# EAGLE board ESP32 Display 3.5 inch V1.0 (EAGLE 9.6.2)
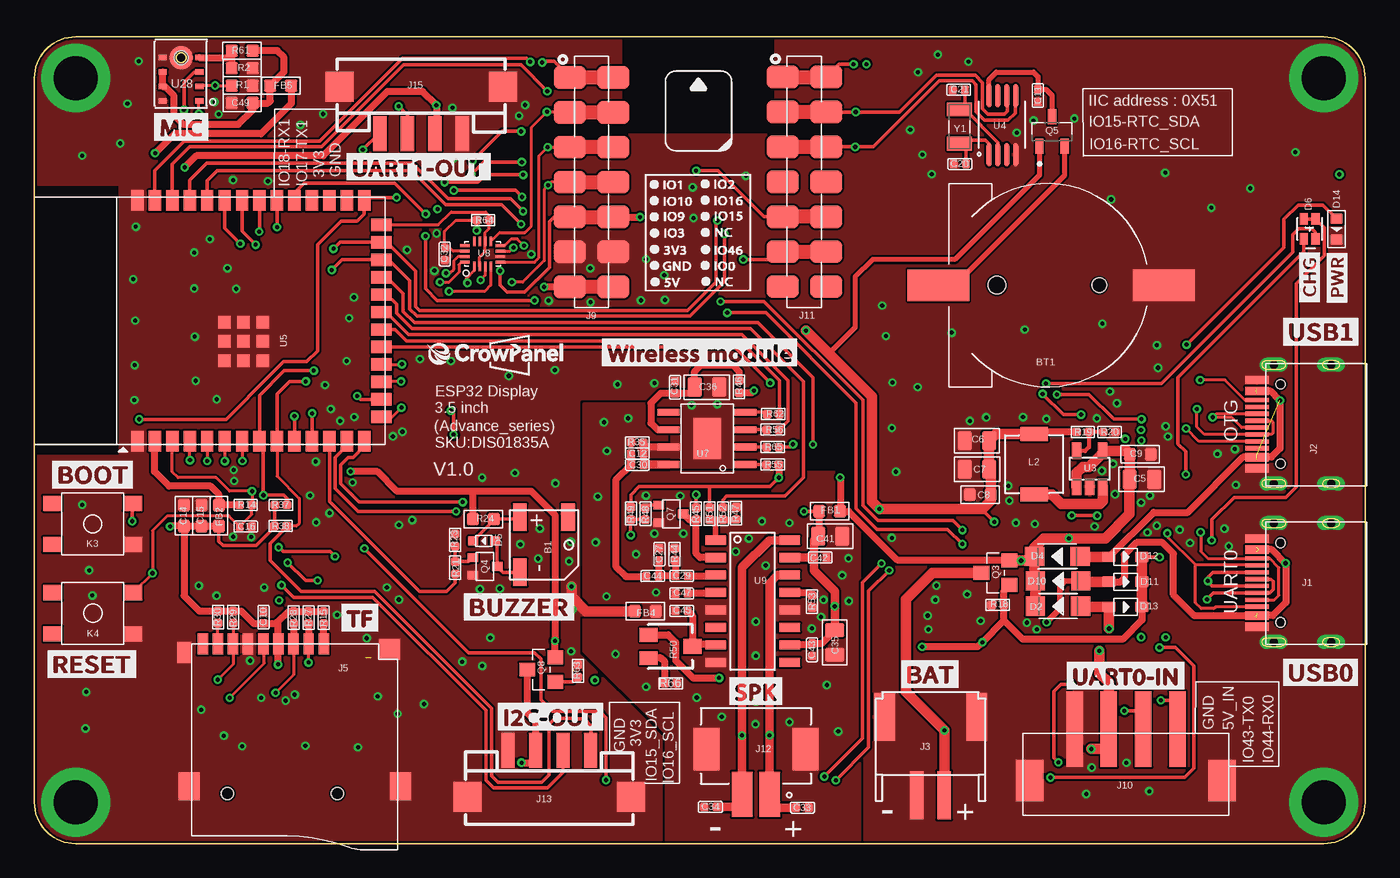
[diagram p3: board, top side]
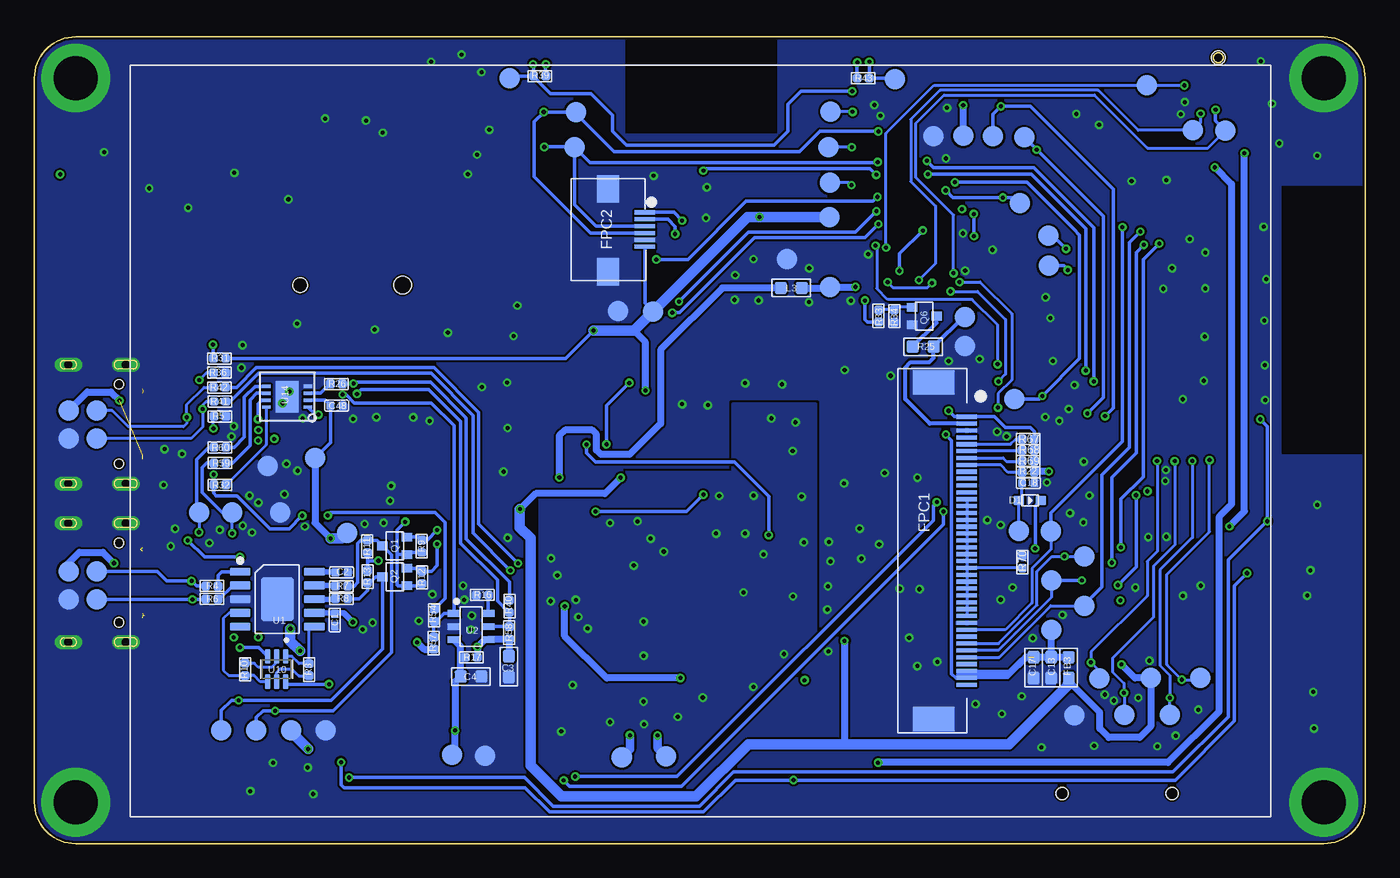
[diagram p4: board, bottom side, seen from below]

Size 96.8 x 58.7 mm. Coordinates in mm from the lower left corner, seen from the top.
Outline: 0,55.7 0,3 arc90 3,0 93.8,0 arc90 96.8,3 96.8,55.7 arc90 93.8,58.7 3,58.7 arc90 0,55.7
Copper layers (1*16): Top 0.035mm / dielectric 1.5mm / Bottom 0.035mm
Design rules "HMI_GZ *": minimum track width 8mil, minimum drill 0.3mm, track to track 6mil, track to pad 6mil, pad to pad 4mil, via to via 6mil, smd to smd 6mil, copper to edge 6mil, drill to drill 4mil, minimum pad ring 6mil, minimum via ring 6mil, stop-mask expansion 4mil, vias tented up to drill 100mil, thermal gap 0mil
tKeepout: area 51.3,17 to 62.7,25.4
tRestrict: area 0,28.3 to 6.1,47.8; area 42.8,51.7 to 53.8,58.7
bRestrict: area 0,28.3 to 6.1,47.8; area 42.8,51.7 to 53.8,58.7

## Footprints (pad centres in the part's own frame; a part is rotated, then mirrored left to right if it is on the bottom)
BEEP_5025 = smd 2 x 1: 1 -2,-1.75; 2 2,-1.75; 3 -2,1.75
CR1220 = smd 2.3 x 4.5: N 0,8.425; P 0,-7.975 | hole 1.3: 0,-3.725 | hole 1.05: 0,3.725
C0402 = smd 0.6 x 0.6: 1 -0.45,0; 2 0.45,0
C0603 = smd 0.889 x 0.889: 1 -0.762,0; 2 0.762,0
C0805 = smd 1.016 x 1.397: 1 -0.889,0; 2 0.889,0
D_SOD523 = smd 0.762 x 0.7: + -0.8,0; - 0.8,0
D_SOD123FL = smd 1.397 x 1.397: + -1.651,0; - 1.651,0
LED_KT-0603RYG = smd 0.85 x 0.6: 1 0.725,-0.425; 2 0.725,0.425; 3 -0.725,-0.425; 4 -0.725,0.425
D_SOD323 = smd 1 x 0.8: + -1.2,0; - 1.2,0
LED0603 = smd 0.762 x 0.889: + -0.762,0; - 0.762,0
L0603 = smd 0.889 x 0.889: 1 -0.762,0; 2 0.762,0
COOPER_0.5MM*40P = smd 0.3 x 1.5: P$1 -8.81,1.73; P$2 -8.31,1.73; P$3 -7.81,1.73; P$4 -7.31,1.73; P$5 -6.81,1.73; P$6 -6.31,1.73; P$7 -5.81,1.73; P$8 -5.31,1.73; P$9 -4.81,1.73; P$10 -4.31,1.73; P$11 -3.81,1.73; P$12 -3.31,1.73; P$13 -2.81,1.73; P$14 -2.31,1.73; P$15 -1.81,1.73; P$16 -1.31,1.73; P$17 -0.81,1.73; P$18 -0.31,1.73; P$19 0.19,1.73; P$20 0.69,1.73; P$21 1.19,1.73; P$22 1.69,1.73; P$23 2.19,1.73; P$24 2.69,1.73; P$25 3.19,1.73; P$26 3.69,1.73; P$27 4.19,1.73; P$28 4.69,1.73; P$29 5.19,1.73; P$30 5.69,1.73; P$31 6.19,1.73; P$32 6.69,1.73; P$33 7.19,1.73; P$34 7.69,1.73; P$35 8.19,1.73; P$36 8.69,1.73; P$37 9.19,1.73; P$38 9.69,1.73; P$39 10.19,1.73; P$40 10.69,1.73 | smd 1.8 x 3: P$41 -11.31,-0.67; P$42 13.19,-0.67
FPC-6PIN-0.5MM = smd 0.3 x 1.5: 1 -1.31,2.184; 2 -0.81,2.184; 3 -0.31,2.184; 4 0.19,2.184; 5 0.69,2.184; 6 1.19,2.184 | smd 2 x 1.6: 7 -3.01,-0.496; 8 3.036,-0.496
USB-3.0TYPEC-SMD = smd 0.3 x 1.7: A1 -3.35,0.5; A4 -2.55,0.5; A5 -1.25,0.5; A6 -0.25,0.5; A7 0.25,0.5; A8 1.25,0.5; A9 2.55,0.5; A12 3.35,0.5; B1 3.05,0.5; B4 2.25,0.5; B5 1.75,0.5; B6 0.75,0.5; B7 -0.75,0.5; B8 -1.75,0.5; B9 -2.25,0.5; B12 -3.05,0.5 | drill 0.6 pad 1.016 long: P$1 -4.325,-0.72; P$2 4.325,-0.72; P$3 -4.325,-4.9; P$4 4.325,-4.9 | hole 0.68: -2.89,-1.22; 2.89,-1.22
PH2.0WT-2PIN = smd 1 x 3.5: P$1 -1,0; P$2 1,0 | smd 1.5 x 3.5: P$3 -3.35,-5.7; P$4 3.35,-5.7
THO-M3.2*5MM-HOLE = drill 3.2 pad 5: P$1 0,0
9P-SMD-W/-RING = smd 1.524 x 0.762: 1 0,4.4; 2 0,3.3; 3 0,2.2; 4 0,1.1; 5 0,0; 6 0,-1.1; 7 0,-2.2; 8 0,-3.3; 9 0,-4.4 | smd 1.524 x 1.016: G1 0.6,-5.746 | smd 2.032 x 1.524: G2 10.373,-5.4; G3 10.373,10 | smd 1.524 x 1.524: G4 0.392,9.181 | hole 0.889: 10.9,-2.6; 10.9,5.4
H7-2.54-18.28X2.5X5MM = smd 1.65 x 2.3: 1 -7.62,-1.58; 1-1 -7.62,1.58; 2 -5.08,-1.58; 2-2 -5.08,1.58; 3 -2.54,-1.58; 3-3 -2.54,1.58; 4 0,-1.58; 4-4 0,1.58; 5 2.54,-1.58; 5-5 2.54,1.58; 6 5.08,-1.58; 6-6 5.08,1.58; 7 7.62,-1.58; 7-7 7.62,1.58
XH2.54-4P-SMD = smd 1.2 x 5.5: 1 -3.75,-1.875; 2 -1.25,-1.875; 3 1.25,-1.875; 4 3.75,-1.875 | smd 2 x 3: 5 -7,1.875; 6 7,1.875
CONN-TH_2P-P2.00_XUNPU_WAFER-PH2.0-2PLB = smd 1.5 x 3.3: 1 -1,1.65; 2 1,1.65 | smd 1.9 x 3.1: 3 3.6,-1.65; 4 -3.6,-1.65
CONNECTOR_4P-SMD-2.0 = smd 0.965 x 2.54: 1 -3,0; 2 -1,0; 3 1,0; 4 3,0 | smd 2.032 x 2.184: SS1 -5.946,3.4; SS2 5.946,3.4
KEY-4.5X4.5-SMD = smd 1.35 x 1.1: 1 -2.925,1.5; 2 -2.925,-1.5; 3 2.925,-1.5; 4 2.925,1.5
L0420 = smd 2 x 1: 1 0,2.2; 2 0,-2.2
TEST_PAD-1.5MM = smd 1.5 x 1.5: P$1 0,0
MOS_SOT323 = smd 0.635 x 0.762: 1 -0.635,-0.889; 2 0.635,-0.889; 3 0,0.889
PMOS_SOT23 = smd 1.016 x 1.143: 1 -0.889,-1.016; 2 0.889,-1.016; 3 0,1.016
SOT-23 = smd 1.09 x 0.61: 1 -1.07,0.915; 2 -1.07,-0.915; 3 1.07,0
R0603-SP = smd 0.889 x 0.889: 1 -0.762,0; 2 0.762,0
R0402 = smd 0.635 x 0.635: 1 -0.445,0; 2 0.445,0
3P-SMD-SQUA-3.6X3.3 = smd 1 x 1.3: 1 -0.85,-1.6; 3 0.85,-1.6 | smd 1.1 x 1.3: 2 0,1.6
ESOP-10-EP-150MIL = smd 1.5 x 0.6: 1 -2.7,2; 2 -2.7,1; 3 -2.7,0; 4 -2.7,-1; 5 -2.7,-2; 6 2.7,-2; 7 2.7,-1; 8 2.7,0; 9 2.7,1; 10 2.7,2 | smd 2.4 x 3.2: EP 0,0
SOT23-6L = smd 0.5 x 0.9: 1 -0.961,-1.212; 2 -0.011,-1.212; 3 0.94,-1.212; 4 0.94,1.288; 5 -0.011,1.288; 6 -0.961,1.288
IC_SOT23-5 = smd 0.69 x 1.2: 1 -0.95,-1.3; 2 0,-1.3; 3 0.95,-1.3; 4 0.95,1.3; 5 -0.95,1.3
MSOP-8 = smd 0.364 x 1.692: 1 -0.975,-2.146; 2 -0.325,-2.146; 3 0.325,-2.146; 4 0.975,-2.146; 5 0.975,2.146; 6 0.325,2.146; 7 -0.325,2.146; 8 -0.975,2.146
ESP32-S3-WROOM-1-SMD41 = smd 1.5 x 0.9: 1 -8.75,5.26; 2 -8.75,3.99; 3 -8.75,2.72; 4 -8.75,1.45; 5 -8.75,0.18; 6 -8.75,-1.09; 7 -8.75,-2.36; 8 -8.75,-3.63; 9 -8.75,-4.9; 10 -8.75,-6.17; 11 -8.75,-7.44; 12 -8.75,-8.71; 13 -8.75,-9.98; 14 -8.75,-11.25; 27 8.75,-11.25; 28 8.75,-9.98; 29 8.75,-8.71; 30 8.75,-7.44; 31 8.75,-6.17; 32 8.75,-4.9; 33 8.75,-3.63; 34 8.75,-2.36; 35 8.75,-1.09; 36 8.75,0.18; 37 8.75,1.45; 38 8.75,2.72; 39 8.75,3.99; 40 8.75,5.26 | smd 0.9 x 1.5: 15 -6.985,-12.5; 16 -5.715,-12.5; 17 -4.445,-12.5; 18 -3.175,-12.5; 19 -1.905,-12.5; 20 -0.635,-12.5; 21 0.635,-12.5; 22 1.905,-12.5; 23 3.175,-12.5; 24 4.445,-12.5; 25 5.715,-12.5; 26 6.985,-12.5 | smd 0.9 x 0.9: 41 -2.9,-1.06; 42 -1.5,-1.06; 43 -0.1,-1.06; 44 -2.9,-2.46; 45 -1.5,-2.46; 46 -0.1,-2.46; 47 -2.9,-3.86; 48 -1.5,-3.86; 49 -0.1,-3.86
NS4168-ESOP-8 = smd 1.6 x 0.5: 1 -2.8,1.905; 2 -2.8,0.635; 3 -2.8,-0.635; 4 -2.8,-1.905; 5 2.8,-1.905; 6 2.8,-0.635; 7 2.8,0.635; 8 2.8,1.905 | smd 2 x 3: 9 0,0
IC_SGM3799_TQFN2.6X1.8_16L = smd 0.2 x 0.7: 1 -0.6,-0.9; 2 -0.2,-0.9; 3 0.2,-0.9; 4 0.6,-0.9; 9 0.6,0.9; 10 0.2,0.9; 11 -0.2,0.9; 12 -0.6,0.9 | smd 0.7 x 0.2: 5 1.3,-0.6; 6 1.3,-0.2; 7 1.3,0.2; 8 1.3,0.6; 13 -1.3,0.6; 14 -1.3,0.2; 15 -1.3,-0.2; 16 -1.3,-0.6
SOP-16 = smd 0.66 x 1.5: 1 -4.445,-2.7; 2 -3.175,-2.7; 3 -1.905,-2.7; 4 -0.635,-2.7; 5 0.635,-2.7; 6 1.905,-2.7; 7 3.175,-2.7; 8 4.445,-2.7; 9 4.445,2.7; 10 3.175,2.7; 11 1.905,2.7; 12 0.635,2.7; 13 -0.635,2.7; 14 -1.905,2.7; 15 -3.175,2.7; 16 -4.445,2.7
SOP65P210X100-6N = smd 1.09 x 0.4: 1 -0.92,0.65; 2 -0.92,0; 3 -0.92,-0.65; 4 0.92,-0.65; 5 0.92,0; 6 0.92,0.65
DFN8 = smd 0.61 x 0.25: 1 -1.5,0.75; 2 -1.5,0.25; 3 -1.5,-0.25; 4 -1.5,-0.75; 5 1.5,-0.75; 6 1.5,-0.25; 7 1.5,0.25; 8 1.5,0.75 | smd 1.7 x 2.3: P$9 0,0
ICS_43432_IIS_INMP441 = smd 0.6 x 0.4: 1 1.203,-0.991; 2 1.203,0.059; 3 1.203,1.109; 4 1.203,2.159; 6 -1.457,2.159; 7 -1.457,1.109; 8 -1.457,0.059; 9 -1.457,-0.991 | smd 1.7 x 1.7: 5 -0.127,2.159 | hole 1: -0.127,2.159
SMD3215-2P = smd 1 x 1.8: 1 -1.25,0; 2 1.25,0

## Placement (x,y rotation side)
B1  BEEP_5025  [BEEP_5025]  37.07,21.74 270 top
BT1  CR1220  [CR1220]  73.73,40.63 270 top
C1  1uF  [C0402]  74.95,16.27 90 bottom
C2  1uF  [C0402]  74.45,19.73 180 bottom
C3  1uF/0603  [C0603]  62.29,12.88 90 bottom
C4  10uF/0603  [C0603]  65.04,12.16 180 bottom
C5  22uF/0805  [C0805]  80.55,26.5 180 top
C6  22uF/0805  [C0805]  68.56,29.31 0 top
C7  22uF/0805  [C0805]  68.57,27.24 0 top
C8  1uF/0603  [C0603]  68.8,25.38 0 top
C9  1uF/0603  [C0603]  80.44,28.33 180 top
C10  1uF  [C0402]  16.67,16.47 270 top
C11  1uF  [C0402]  73,54.43 270 top
C12  1nF  [C0402]  43.86,28.37 180 top
C13  4.7uF  [C0603]  22.84,12.8 90 bottom
C14  10uF/0603  [C0603]  10.88,23.86 270 top
C15  100nF/0603  [C0603]  12.16,23.86 270 top
C16  1uF  [C0402]  15.38,23.06 180 top
C17  100nF  [C0603]  24.11,12.8 90 bottom
C18  1uF  [C0402]  24.5,26.23 180 bottom
C20  18pF  [C0402]  67.32,49.45 0 top
C21  18pF  [C0402]  67.24,54.84 180 top
C27  100nF/NC  [C0402]  45.46,21.06 270 top
C29  100nF  [C0402]  47.09,19.48 180 top
C30  10uF  [C0402]  43.86,27.56 180 top
C31  100nF  [C0402]  46.61,33.2 90 top
C32  1uF  [C0402]  29.85,42.89 90 top
C33  1nF  [C0402]  55.87,2.62 180 top
C34  1nF  [C0402]  49.18,2.67 0 top
C35  22uF/0805  [C0805]  58.22,14.64 90 top
C36  47uF/0805  [C0805]  48.92,33.21 0 top
C41  22uF/0805  [C0805]  57.89,22.36 180 top
C42  100nF  [C0402]  57.16,20.82 0 top
C43  100nF  [C0402]  56.58,14.1 270 top
C44  1uF  [C0402]  44.97,19.46 180 top
C45  100nF  [C0402]  47.08,16.94 0 top
C47  4.7uF  [C0402]  47.08,18.2 0 top
C48  1uF  [C0402]  74.81,31.86 180 bottom
C49  100nF  [C0603]  15.12,53.88 0 top
D1  B5819WT  [D_SOD523]  24.38,24.97 0 bottom
D2  DSS34  [D_SOD123FL]  74.46,17.27 180 top
D4  DSS34  [D_SOD123FL]  74.41,20.89 180 top
D5  B5819WT  [D_SOD523]  32.71,22.03 180 top
D6  KT-0603RYG  [LED_KT-0603RYG]  92.76,44.72 90 top
D10  DSS34  [D_SOD123FL]  74.47,19.11 180 top
D11  1N5817WS  [D_SOD323]  79.37,19.05 0 top
D12  1N5817WS  [D_SOD323]  79.37,20.86 0 top
D13  1N5817WS  [D_SOD323]  79.37,17.22 0 top
D14  Red  [LED0603]  94.73,44.7 270 top
FB1  0R/800mA  [L0603]  57.84,24.18 180 top
FB2  0R/800mA  [L0603]  13.43,23.86 90 top
FB3  0R/800mA  [L0603]  21.56,12.8 90 bottom
FB4  0R/800mA  [L0603]  44.44,16.91 180 top
FB5  0R/800mA  [L0603]  17.92,55.14 180 top
FPC1  3.5-TFT-FPC-40PIN-0.5MM  [COOPER_0.5MM*40P]  30.71,22.25 270 bottom
FPC2  FPC-6PIN-0.5MM  [FPC-6PIN-0.5MM]  54.58,44.62 270 bottom
J1  TYPEC-3.0-16P-SMD  [USB-3.0TYPEC-SMD]  89.43,18.99 90 top
J2  TYPEC-3.0-16P-SMD  [USB-3.0TYPEC-SMD]  89.43,30.52 90 top
J3  PH2.0WT-2PIN  [PH2.0WT-2PIN]  65.18,3.52 180 top
J4  THO-M3.25MM-HOLE  [THO-M3.2*5MM-HOLE]  3,3 0 top
J5  [9P-SMD-W/-RING]  16.65,14.53 270 top
J6  THO-M3.25MM-HOLE  [THO-M3.2*5MM-HOLE]  3,55.7 0 top
J7  THO-M3.25MM-HOLE  [THO-M3.2*5MM-HOLE]  93.8,3 0 top
J8  THO-M3.25MM-HOLE  [THO-M3.2*5MM-HOLE]  93.8,55.7 0 top
J9  [H7-2.54-18.28X2.5X5MM]  40.53,48.13 270 top
J10  XH2.54-4P-SMT  [XH2.54-4P-SMD]  79.4,6.46 180 top
J11  [H7-2.54-18.28X2.5X5MM]  56.01,48.15 270 top
J12  WAFER-PH2.0-2PLB  [CONN-TH_2P-P2.00_XUNPU_WAFER-PH2.0-2PLB]  52.49,5.24 180 top
J13  HY2.0-4P-SMT  [CONNECTOR_4P-SMD-2.0]  37.46,6.79 180 top
J15  HY2.0-4P-SMT  [CONNECTOR_4P-SMD-2.0]  28.14,51.66 0 top
K3  KEY-4.5X4.5  [KEY-4.5X4.5-SMD]  4.24,23.26 180 top
K4  KEY-4.5X4.5  [KEY-4.5X4.5-SMD]  4.25,16.76 180 top
L2  4.7uH/3A  [L0420]  72.73,27.61 180 top
L3  NC  [L0603]  41.74,40.43 180 bottom
P1  TEST_PADPAD-1.5MM  [TEST_PAD-1.5MM]  94.31,19.81 0 bottom
P2  TEST_PADPAD-1.5MM  [TEST_PAD-1.5MM]  92.27,19.81 0 bottom
P3  TEST_PADPAD-1.5MM  [TEST_PAD-1.5MM]  92.27,17.78 0 bottom
P4  TEST_PADPAD-1.5MM  [TEST_PAD-1.5MM]  94.31,17.78 0 bottom
P5  TEST_PADPAD-1.5MM  [TEST_PAD-1.5MM]  94.31,31.51 0 bottom
P6  TEST_PADPAD-1.5MM  [TEST_PAD-1.5MM]  92.27,29.48 0 bottom
P7  TEST_PADPAD-1.5MM  [TEST_PAD-1.5MM]  92.27,31.51 0 bottom
P8  TEST_PADPAD-1.5MM  [TEST_PAD-1.5MM]  94.31,29.48 0 bottom
P9  TEST_PADPAD-1.5MM  [TEST_PAD-1.5MM]  66.42,6.47 0 bottom
P10  TEST_PADPAD-1.5MM  [TEST_PAD-1.5MM]  64.02,6.38 0 bottom
P11  TEST_PADPAD-1.5MM  [TEST_PAD-1.5MM]  74.06,22.6 270 bottom
P12  TEST_PADPAD-1.5MM  [TEST_PAD-1.5MM]  78.92,24.08 270 bottom
P13  TEST_PADPAD-1.5MM  [TEST_PAD-1.5MM]  15.59,12.05 0 bottom
P14  TEST_PADPAD-1.5MM  [TEST_PAD-1.5MM]  82.4,24.09 270 bottom
P15  TEST_PADPAD-1.5MM  [TEST_PAD-1.5MM]  19.34,12.04 0 bottom
P16  TEST_PADPAD-1.5MM  [TEST_PAD-1.5MM]  17.51,9.37 0 bottom
P17  TEST_PADPAD-1.5MM  [TEST_PAD-1.5MM]  78.13,8.25 0 bottom
P18  TEST_PADPAD-1.5MM  [TEST_PAD-1.5MM]  75.61,8.25 0 bottom
P19  TEST_PADPAD-1.5MM  [TEST_PAD-1.5MM]  80.65,8.25 0 bottom
P20  TEST_PADPAD-1.5MM  [TEST_PAD-1.5MM]  83.2,8.25 0 bottom
P21  TEST_PADPAD-1.5MM  [TEST_PAD-1.5MM]  38.94,48.09 180 bottom
P22  TEST_PADPAD-1.5MM  [TEST_PAD-1.5MM]  39.03,50.67 180 bottom
P23  TEST_PADPAD-1.5MM  [TEST_PAD-1.5MM]  38.89,53.27 180 bottom
P24  TEST_PADPAD-1.5MM  [TEST_PAD-1.5MM]  15.87,55.17 180 bottom
P25  TEST_PADPAD-1.5MM  [TEST_PAD-1.5MM]  14.21,9.37 0 bottom
P26  TEST_PADPAD-1.5MM  [TEST_PAD-1.5MM]  12,12.05 0 bottom
P27  TEST_PADPAD-1.5MM  [TEST_PAD-1.5MM]  12.52,51.9 180 bottom
P28  TEST_PADPAD-1.5MM  [TEST_PAD-1.5MM]  21.15,9.35 0 bottom
P29  TEST_PADPAD-1.5MM  [TEST_PAD-1.5MM]  10.16,51.88 180 bottom
P30  TEST_PADPAD-1.5MM  [TEST_PAD-1.5MM]  54.07,6.27 90 bottom
P31  TEST_PADPAD-1.5MM  [TEST_PAD-1.5MM]  25.1,46.6 180 bottom
P32  TEST_PADPAD-1.5MM  [TEST_PAD-1.5MM]  25.53,32.36 180 bottom
P38  TEST_PADPAD-1.5MM  [TEST_PAD-1.5MM]  51.79,38.73 0 bottom
P39  TEST_PADPAD-1.5MM  [TEST_PAD-1.5MM]  57.51,50.67 0 bottom
P40  TEST_PADPAD-1.5MM  [TEST_PAD-1.5MM]  57.41,53.23 0 bottom
P41  TEST_PADPAD-1.5MM  [TEST_PAD-1.5MM]  54.34,38.75 0 bottom
P42  TEST_PADPAD-1.5MM  [TEST_PAD-1.5MM]  50.85,6.35 90 bottom
P44  TEST_PADPAD-1.5MM  [TEST_PAD-1.5MM]  29.23,51.5 0 bottom
P45  TEST_PADPAD-1.5MM  [TEST_PAD-1.5MM]  31.39,51.47 0 bottom
P46  TEST_PADPAD-1.5MM  [TEST_PAD-1.5MM]  27.06,51.46 0 bottom
P47  TEST_PADPAD-1.5MM  [TEST_PAD-1.5MM]  24.79,51.39 0 bottom
P49  TEST_PADPAD-1.5MM  [TEST_PAD-1.5MM]  25.2,22.74 0 bottom
P50  TEST_PADPAD-1.5MM  [TEST_PAD-1.5MM]  20.43,20.89 180 bottom
P51  TEST_PADPAD-1.5MM  [TEST_PAD-1.5MM]  22.83,19.16 180 bottom
P52  TEST_PADPAD-1.5MM  [TEST_PAD-1.5MM]  20.42,17.3 180 bottom
P53  TEST_PADPAD-1.5MM  [TEST_PAD-1.5MM]  22.86,22.73 180 bottom
P55  TEST_PADPAD-1.5MM  [TEST_PAD-1.5MM]  22.83,15.55 180 bottom
P56  TEST_PADPAD-1.5MM  [TEST_PAD-1.5MM]  29.1,38.31 180 bottom
P57  TEST_PADPAD-1.5MM  [TEST_PAD-1.5MM]  29.11,36.19 0 bottom
P58  TEST_PADPAD-1.5MM  [TEST_PAD-1.5MM]  62.23,55.68 0 bottom
P59  TEST_PADPAD-1.5MM  [TEST_PAD-1.5MM]  34.2,55.62 0 bottom
P60  TEST_PADPAD-1.5MM  [TEST_PAD-1.5MM]  42.06,42.54 0 bottom
P61  TEST_PADPAD-1.5MM  [TEST_PAD-1.5MM]  38.96,45.59 0 bottom
P62  TEST_PADPAD-1.5MM  [TEST_PAD-1.5MM]  38.93,40.5 0 bottom
P63  TEST_PADPAD-1.5MM  [TEST_PAD-1.5MM]  23.02,42.04 0 bottom
P64  TEST_PADPAD-1.5MM  [TEST_PAD-1.5MM]  23.04,44.22 0 bottom
P74  TEST_PADPAD-1.5MM  [TEST_PAD-1.5MM]  76.38,28.05 270 bottom
P78  TEST_PADPAD-1.5MM  [TEST_PAD-1.5MM]  84.83,24.09 270 bottom
P79  TEST_PADPAD-1.5MM  [TEST_PAD-1.5MM]  79.82,27.47 270 bottom
Q1  BSS138W_SOT323  [MOS_SOT323]  70.58,21.66 90 bottom
Q2  BSS138W_SOT323  [MOS_SOT323]  70.58,19.4 90 bottom
Q3  AO3401  [PMOS_SOT23]  69.91,19.7 90 top
Q4  SS8050W-SOT323  [MOS_SOT323]  32.77,20.16 270 top
Q5  BAT54C-7-F  [SOT-23]  74.02,51.81 90 top
Q6  SS8050W-SOT323  [MOS_SOT323]  32.07,38.39 270 bottom
Q7  BSS138W_SOT323  [MOS_SOT323]  46.32,23.99 270 top
Q8  AO3401  [PMOS_SOT23]  36.87,12.66 90 top
R1  4.7K  [R0603-SP]  15.11,55.14 0 top
R2  0R  [R0603-SP]  15.11,56.42 180 top
R3  10K  [R0402]  76.83,12.66 90 bottom
R4  0R  [R0402]  83.89,18.74 180 bottom
R5  5.1K  [R0402]  83.31,31.09 180 bottom
R6  0R  [R0402]  83.89,17.79 180 bottom
R7  0R  [R0402]  74.46,18.73 180 bottom
R8  0R  [R0402]  74.46,17.81 180 bottom
R9  4.7k  [R0402]  68.62,21.63 270 bottom
R10  10K  [R0402]  81.48,12.68 270 bottom
R11  4.7k  [R0402]  72.58,21.62 270 bottom
R12  4.7k  [R0402]  68.61,19.37 270 bottom
R13  4.7k  [R0402]  72.57,19.42 90 bottom
R14  10K  [R0402]  15.37,24.64 180 top
R15  10K  [R0402]  21.04,16.45 90 top
R16  2K  [R0402]  64.21,18.09 0 bottom
R17  5.1K  [R0402]  65.02,13.55 0 bottom
R18  10K  [R0402]  70.08,17.36 0 top
R19  45.3K  [R0402]  76.27,29.95 180 top
R20  10K  [R0402]  78.2,29.95 180 top
R21  1K  [R0402]  30.62,20.07 270 top
R22  10K  [R0402]  24.5,27.02 0 bottom
R23  47K  [R0402]  30.6,22.09 90 top
R24  3.9R/0603  [R0603-SP]  32.66,23.61 180 top
R25  3R/0603  [R0603-SP]  32.15,36.16 0 bottom
R26  2K  [R0402]  74.83,33.46 0 bottom
R27  10K  [R0402]  19.94,16.45 90 top
R28  10K  [R0402]  18.86,16.45 90 top
R29  10K  [R0402]  14.46,16.48 90 top
R30  10K  [R0402]  13.36,16.48 90 top
R31  5.1K  [R0402]  83.33,35.3 0 bottom
R32  5.1K  [R0402]  83.3,26.1 180 bottom
R33  1K  [R0402]  35.39,38.4 270 bottom
R34  47K  [R0402]  34.25,38.38 270 bottom
R35  0R  [R0402]  43.85,29.18 0 top
R36  5.1K  [R0402]  83.34,34.26 0 bottom
R37  4.7k  [R0402]  17.94,24.64 180 top
R38  4.7k  [R0402]  17.92,23.1 180 top
R39  0R  [R0402]  60.04,55.85 180 bottom
R40  NC  [R0402]  62.25,17.27 90 bottom
R41  0R  [R0402]  83.3,32.17 180 bottom
R42  0R  [R0402]  83.34,33.2 180 bottom
R43  0R  [R0402]  36.51,55.69 0 bottom
R44  4.7k  [R0402]  46.58,21.06 270 top
R45  10K  [R0402]  48.14,24 90 top
R46  0R  [R0402]  51.27,33.25 90 top
R47  NC  [R0402]  51.05,24.03 270 top
R48  1K  [R0402]  44.45,24 270 top
R49  10K  [R0402]  43.39,24.02 90 top
R50  10K  [3P-SMD-SQUA-3.6X3.3]  46.27,14.34 270 top
R51  10K  [R0402]  49.12,24.01 90 top
R52  1K  [R0402]  50.08,24.01 90 top
R53  47K  [R0402]  56.57,17.61 90 top
R54  NC  [R0402]  67.72,16.61 90 bottom
R55  100k  [R0402]  53.71,27.57 0 top
R56  0R  [R0402]  53.72,30.12 0 top
R57  5.1K  [R0402]  67.75,14.59 90 bottom
R58  5.1K  [R0402]  62.26,15.34 90 bottom
R59  0R  [R0402]  83.3,27.68 0 bottom
R60  0R  [R0402]  83.3,28.83 0 bottom
R61  NC/0R  [R0603-SP]  15.11,57.69 0 top
R62  0R  [R0402]  53.75,31.25 0 top
R63  10K  [R0402]  39.55,12.57 270 top
R64  10K  [R0402]  32.64,45.36 180 top
R65  0R  [R0402]  53.72,28.84 0 top
R66  2K  [R0402]  46.3,11.67 180 top
R67  10K  [R0402]  24.51,29.43 0 bottom
R68  10K  [R0402]  24.51,28.63 0 bottom
R69  10K  [R0402]  24.51,27.83 0 bottom
R70  NC/0R  [R0402]  24.93,20.49 90 bottom
U1  CH340K  [ESOP-10-EP-150MIL]  79.14,17.78 0 bottom
U2  TP4059-SOT23-6  [SOT23-6L]  65.07,15.78 270 bottom
U3  RY3420  [IC_SOT23-5]  76.76,27.27 0 top
U4  BM8563EMA  [MSOP-8]  70.41,52.27 0 top
U5  ESP32-S3-WROOM-1  [ESP32-S3-WROOM-1-SMD41]  12.75,38.04 90 top
U7  NS4168-ESOP-8  [NS4168-ESOP-8]  48.94,29.48 180 top
U8  SGM3799  [IC_SGM3799_TQFN2.6X1.8_16L]  32.6,42.91 0 top
U9  NS4268-SOP16  [SOP-16]  52.25,17.63 270 top
U10  UMH3NTN  [SOP65P210X100-6N]  79.17,12.7 270 bottom
U14  STC8G1K08  [DFN8]  78.41,32.52 180 bottom
U28  ICS_43432_IIS_INMP441  [ICS_43432_IIS_INMP441]  10.8,55.02 0 top
Y1  32.768KHZ  [SMD3215-2P]  67.29,52.17 90 top

## Tracks (layer width: path | path; a pad name or v marks a point on that pad's centre or on a via)
3V3  (via drill 0.3)
  Top 0.203: U8.14 30.47,43.11 30.24,43.34 C32.2 29.85,44.55 30.66,45.36 R64.2
  Top 0.254: R37.2 17.49,23.12 R38.2 17.47,23.03 16.13,21.69 13.73,21.69 13.42,22 13.42,23.09 FB2.1 | R49.2 43.39,25.36 44,25.97 49.12,25.97 | R51.2 49.12,25.97 | v69.82,23.41 68.95,24.28 68.95,24.34 | 49.12,25.97 53.5,25.97 v54.15,26.62 | R64.2 32.18,45.35 v32.18,44.61 | v33.88,41.67 33.88,40.63 34.38,40.13 35.67,40.13 37.46,41.92 37.46,45.26 37.87,45.67 38.87,45.67 J9.5
  Top 0.381: Q5.1 73.11,48.65 66.96,42.5 60.98,42.5 59.7,41.22 59.7,37.56 57.8,35.66
  Top 0.508: R19.2 72.87,29.95 L2.2 | v17.72,13.03 17.72,14.5 J5.4 17.75,16.15 | 17.75,16.15 17.62,16.02 C10.2 15.96,16.02 15.06,16.92 R29.2 R30.2 11.99,16.92 10.88,18.04 C14.2 | 17.75,16.15 18.49,16.89 R28.2 R27.2 R15.2 | C14.2 C15.2 13.41,23.1 13.42,23.09 | Q8.2 37.87,13.56 v37.87,14.75 37.87,23.92 36.16,25.63 31.84,25.63 | FB5.1 18.68,53.85 16.48,51.65 10.2,51.65 v8.78,50.23 | C14.2 9.89,23.1 v9.87,23.08 | v23.01,27.07 24.95,27.07 26.39,25.63 31.84,25.63 | R55.2 v54.15,26.62 | R46.1 52.19,32.8 v52.35,32.97 | J9.5-5 v44.06,45.59 | R24.2 31.9,25.57 31.84,25.63
  Top 0.762: L2.2 69.95,29.81 C6.2 69.45,27.25 C7.2 69.56,27.14 C8.2 69.56,24.95 68.95,24.34 v61.46,24.34 61.46,24.36 60.92,24.9 60.92,32.53 57.8,35.66 v56.12,37.33
  Top 1.016: J9.5 J9.5-5
  Bottom 0.254: R9.2 69.53,21.19 Q1.1 70.4,21.02 70.4,20.77 | 70.4,20.77 70.4,18.84 70.33,18.77 Q2.1 68.77,18.77 R12.2 | FPC2.6 52.4,39.33 P38.P$1 | 70.4,20.77 70.4,22.83 v69.82,23.41 | v32.18,44.61 33.88,42.91 v33.88,41.67 | R31.2 58.15,35.3 v56.12,37.33
  Bottom 0.508: v17.72,13.03 16.74,12.05 P13.P$1 15.59,8.52 16.39,7.72 18.65,7.72 19.31,8.38 19.31,9.54 21.56,11.79 FB3.1 | v37.87,14.75 37.87,7.26 37.85,7.24 | v9.87,23.08 8.78,24.17 v8.78,50.23 | v23.01,27.07 24.01,27.07 R22.2 | v54.15,26.62 55.3,25.47 60.33,25.47 v61.46,24.34 | v52.35,32.97 52.35,36.49 53.19,37.33
  Bottom 0.762: v56.12,37.33 53.19,37.33 P38.P$1 44.93,45.59 v44.06,45.59 P61.P$1 | v61.46,24.34 61.49,24.31 61.49,23 60.72,22.23 60.72,5.71 58.44,3.43 48.66,3.43 44.85,7.24 37.85,7.24 25.91,7.24 21.56,11.59 FB3.1
3V3_1
  Top 0.508: U28.7 U28.8 9.51,55.08 10.13,54.46 10.13,53.04 10.84,52.33 14.84,52.33 15.88,53.37 C49.2 16.99,53.88 17.16,54.05 FB5.2 18.16,56.15 18.16,57.21 17.67,57.7 15.88,57.7 R61.2
3V3_OUT  (via drill 0.3)
  Top 0.508: Q8.3 35.85,9.53 36.46,8.92 J13.3 36.46,6.15 36.2,5.89 v35.43,5.89 | J15.3 29.24,51.76 v29.24,53.72 28.25,54.71 25.68,54.71 21.01,50.04 11.77,50.04 v10.93,49.2
  Bottom 0.508: P44.P$1 v29.23,53.71 v29.24,53.72 | v10.93,49.2 9.72,47.99 9.72,24.68 10.64,23.76 10.64,9.6 14.34,5.9 v35.42,5.9 v35.43,5.89
+5V_IN  (via drill 0.3)
  Top 0.508: v78.17,15.65 v78.18,15.64
  Top 0.762: D2.+ 76.16,17.22 D13.+ v78.17,15.65 | v77.48,14.03 77.48,12.39 78.15,11.72 J10.3 78.15,7.28 77.75,6.88 v76.88,6.88
  Bottom 0.762: v78.18,15.64 78.18,14.73 v77.48,14.03 | P17.P$1 78.13,8.13 v76.88,6.88
+VBUS1  (via drill 0.3)  (5 unrouted)
  Top 0.406: v73.63,16.11 74.58,17.06 74.58,18.69 75,19.11 D10.+
  Top 0.508: 88.9,16.6 90.09,16.6 91.04,17.54 91.04,20.28 91.01,20.31 v91.01,20.4 90.02,21.39 89.08,21.39 | D11.+ 78.2,19.02 78.97,19.02 79.27,19.32 79.27,21.01 80.16,21.9 82.06,21.9 82.86,21.1 82.86,18.11 84.39,16.58 88.79,16.58
  Top 0.762: D10.+ 76.18,19.05 D11.+
  Bottom 0.406: C1.2 75.01,16.78 U1.7 74.3,16.78 v73.63,16.11
  Bottom 0.508: P1.P$1 94.31,20.41 93.53,21.19 91.82,21.19 91.03,20.4 v91.01,20.4
+VBUS2  (via drill 0.3)  (4 unrouted)
  Top 0.508: D12.+ 81.42,24.11 83.91,24.11 87.92,28.12 89.99,28.12 90.61,28.74 v90.61,32.24 89.93,32.92 88.84,32.92
  Top 0.762: D4.+ 76.09,20.86 D12.+
  Bottom 0.508: P5.P$1 92.94,32.87 91.24,32.87 v90.61,32.24
+VC_IN  (via drill 0.3)
  Top 0.254: D6.2 D6.1 93.83,44.8 93.83,42.79 91.79,40.75 91.79,25.95 91.04,25.2 87.27,25.2 85.64,23.57 v85.64,22.06 | v81.85,20.84 80.59,20.84 D12.-
  Top 0.508: D13.- 80.57,16.26 79.17,14.86 71.89,14.86 70.53,16.23 | 70.53,16.23 R18.2 70.53,18.41 Q3.1 | v64.58,14.31 68.61,14.31 v68.95,14.65 70.53,16.23
  Top 0.762: D12.- D11.- D13.-
  Bottom 0.254: 62.26,13.68 C3.2 | U2.4 63.73,14.89 | v85.64,22.06 84.42,20.84 v81.85,20.84
  Bottom 0.508: 62.26,13.68 R58.1 63.73,14.89 | R17.2 v64.58,14.31 64.05,14.84 U2.4 | v68.95,14.65 68.44,14.14 R57.1
A_GND  (via drill 0.3)
  Top 0.254: C47.1 46.43,18
  other vias: 41.43,30.66 43.19,30.95 41.64,28.57 40.98,25.25 40.83,21.92 41.62,17.99 42.28,13.79 44.5,11.41 48.18,10.62 50,9.23 52.45,8.69 54.93,8.84 58.47,8.16 57.64,11.53 56.55,15.65 57.23,16.5 57.41,17.74 59.24,17.64 58.76,19.52 59.22,20.76 51.02,21.24 51.97,22.19 52.92,23.45 54.93,23.33 43.77,21.05 44.48,25.32 45.1,22.56 47.21,22.56 46.98,25.3 52.49,10.33 52.48,13.67 52.48,16.15 53.2,20.23 45.22,18.28
  pour Top: 40.4,13.6 45,9 46,8 46,0 60,0 60,27 46,27 46,32 40,32 40,14
  pour Bottom: 40,32 40,14 46,8 46,0 60,0 60,27 46,27 46,32
AOUT_R
  Top 0.508: C30.2 42.29,26.44 42.29,20.18 43.03,19.44 44.5,19.44 C44.2
  Top 0.635: C30.2 C12.2
AVCC_AMP  (via drill 0.3)
  Top 0.254: R45.2 v48.14,25.39 | v55.98,24.16 57.06,24.16 FB1.2
  Top 0.508: C35.2 57.24,14.55 C43.1 56.48,14.46 U9.10 | FB1.2 57.08,22.44 C41.2 | R50.1 46.1,15.19 46.64,14.65 46.64,13.33 47.92,12.05 v49.81,12.05
  Top 0.635: C35.2 v58.22,17.27 58.22,18.35 56.71,19.86 C42.1 | C42.1 56.71,22.07 C41.2 | U9.15 54.97,20.82 C42.1
  Bottom 0.254: v48.14,25.39 49.37,24.16 v55.98,24.16
  Bottom 0.508: v49.81,12.05 55.18,12.05 58.22,15.09 v58.22,17.27
C_LED
  Bottom 0.203: U14.8 79.94,31.73 79.94,29.01 R32.1
CH_EN  (via drill 0.3)
  Top 0.203: U5.3 10.03,27.05 10.45,26.63 13.21,26.63 14.2,25.64 v15.83,25.64 15.83,24.66 R14.1 15.81,23.96 14.93,23.08 C16.2 14.14,23.85 9.67,23.85 8.59,22.77 v8.59,19.68 K4.2
  Top 0.254: v75.37,11.6 74.67,11.6 74.15,11.08 74.15,6.26 v74.49,5.92 | v24,21.48 31.6,13.88 36.4,13.88 36.84,13.44 36.84,10.45 37.68,9.61 41.13,9.61 41.58,9.16 v41.58,4.62
  Bottom 0.254: U10.6 78.34,11.6 v75.37,11.6 | v74.49,5.92 74.49,5.05 74.49,4.28 74.27,4.06 61.09,4.06 59.34,2.31 48.12,2.31 45.81,4.62 v41.58,4.62 13.82,4.62 9.5,8.94 9.5,18.77 v8.59,19.68 | D1.- 24,24.55 v24,21.48
CHRG  (via drill 0.3)
  Top 0.254: v80.53,30.88 78.51,30.88 76.71,32.68 v74.38,32.68
  Bottom 0.254: R57.2 67.75,16.12 R54.1 67.57,16.16 66.99,16.74 U2.1 66.28,30.42 67.93,32.07 73.53,32.07 74.14,32.68 v74.38,32.68 | U14.7 80.26,32.27 80.53,32 v80.53,30.88
D_LED
  Bottom 0.254: R26.1 75.97,32.77 U14.3
DA1
  Top 0.203: J5.8 13.35,16.03 R30.1
DA2
  Top 0.508: J5.1 R15.1
DONE  (via drill 0.3)
  Top 0.254: v76.14,31.21 74.85,31.21 v73.34,32.72
  Bottom 0.254: U2.5 R58.2 | R58.2 | R58.2 62.25,15.8 R40.1 62.3,16.82 63.12,17.65 63.12,19.17 65.79,21.84 65.79,30.7 68.11,33.02 73.04,33.02 v73.34,32.72 | U14.1 76.36,31.21 v76.14,31.21
DTR
  Bottom 0.203: U1.4 82.65,16.78 83.05,16.38 83.05,12.62 82.66,12.23 R10.2 80.82,12.23 80.37,11.78 U10.4
ESP_3V3
  Top 0.508: R14.2 13.45,24.64 FB2.2 13.43,25.4 12.82,26.01 9.8,26.01 8.75,27.06 8.75,29.27 U5.2
ESP_D+  (via drill 0.3)
  Top 0.254: v61.62,20.39 60.25,19.02 60.25,7.67 v57.46,4.88 | v31.16,24.85 23.62,24.85 22.28,26.19 22.28,27.55 22.81,28.08 23.17,28.08 24,28.91 U5.14
  Bottom 0.254: R42.1 82.09,33.2 80.66,34.63 67.74,34.63 64.48,31.37 64.48,23.25 v61.62,20.39 | v57.46,4.88 50.05,4.88 31.42,23.51 31.42,24.59 v31.16,24.85
ESP_D-  (via drill 0.3)
  Top 0.254: v62.18,19.88 60.68,18.38 60.68,6.99 v58.3,4.61 | v30.68,24.16 23.55,24.16 21.87,25.84 21.87,28.1 22.73,28.96 U5.13
  Bottom 0.254: R41.1 82.54,32.17 80.49,34.22 67.96,34.22 64.89,31.15 64.89,22.59 v62.18,19.88 | v58.3,4.61 57.87,4.18 49.74,4.18 30.68,23.24 v30.68,24.16
ESP_RXD0  (via drill 0.3)
  Top 0.254: U5.36 12.57,48.25 13.3,48.98 27.43,48.98 29.91,46.5 33.97,46.5 v35.41,45.07 | v50.4,38.63 53.21,38.63 59.77,32.07 59.77,24.39 61.29,22.87 66.42,22.87 v67.5,21.79
  Bottom 0.254: Q2.2 68.83,20.04 R12.1 67.92,19.81 67.49,20.24 67.49,21.78 v67.5,21.79 | v35.41,45.07 36.38,44.09 44.41,44.09 49.87,38.63 v50.4,38.63
ESP_RXD1  (via drill 0.3)
  Top 0.254: v20.2,31.3 U5.11 | J15.1 25.07,51.66 v23.89,50.49
  Bottom 0.254: P47.P$1 v23.89,50.49 19.05,45.64 19.05,32.45 v20.2,31.3
ESP_RXD2  (via drill 0.3)
  Top 0.254: v37.31,54.74 35.39,56.66 26.87,56.66 20.91,50.69 11.28,50.69 10.03,49.44 U5.38
  Bottom 0.254: R39.2 62.06,55.85 P58.P$1 | R39.2 60.49,56.68 v60.52,56.71 | R39.2 60.2,55.55 60.2,55.51 59.24,54.55 56.3,54.55 54.73,52.98 54.73,51.82 53.73,50.82 43,50.82 41.97,51.85 41.97,53.8 41.03,54.74 v37.31,54.74
ESP_TXD0  (via drill 0.3)
  Top 0.254: v67.5,22.81 66.81,23.5 61.36,23.5 60.26,24.6 60.26,32.26 53.08,39.43 v49.9,39.43 | v35.55,46.01 34.65,46.91 30.08,46.91 27.48,49.51 12.53,49.51 11.3,48.28 U5.37
  Bottom 0.254: Q1.2 68.84,22.3 R9.1 68.24,22.07 v67.5,22.81 | v49.9,39.43 44.84,44.5 37.06,44.5 v35.55,46.01
ESP_TXD1  (via drill 0.3)
  Top 0.254: U5.10 18.92,31.09 v18.91,31.1 | v26.5,53.64 27.14,53 J15.2
  Bottom 0.254: v18.91,31.1 18.33,31.68 18.33,47.62 24.35,53.64 v26.5,53.64 27.06,53.08 P46.P$1
ESP_TXD2  (via drill 0.3)
  Top 0.254: U5.39 8.76,48.96 10.91,51.11 20.75,51.11 26.8,57.16 35.79,57.16 v36.07,56.88
  Bottom 0.254: v36.07,56.88 R43.2 | R43.2 | R43.2 34.27,55.69 P59.P$1
GND  (via drill 0.3)
  Top 0.508: R35.2 44.31,29.17 44.31,28.88 | 44.31,28.88 C12.1 | U7.7 44.34,28.84 44.31,28.88
  Top 0.762: FB4.2 40.14,16.91 39.07,17.98 v39.07,18.72
  other vias: 77.66,27.13 78.61,25.42 78.47,27.63 7.27,32.28 7.3,34.81 7.33,38.05 7.19,41.06 7.38,44.88 3.48,50.05 6.25,50.94 6.77,53.83 7.59,56.92 13.4,53.07 13.11,53.95 30.41,53.53 30.5,49.85 35.7,53.74 35.26,52.95 44.49,42.53 45.82,41.36 45.86,39.56 44.12,39.53 29.09,41.68 29.26,44.4 23.24,39.75 22.9,38.24 27.1,43.2 21,53.09 19.35,52.3 16.99,48.2 14.45,48.28 28.04,35.25 30.29,35.11 34.51,34.04 37.86,34.46 36.15,42.88 33.17,14.98 32.41,18.51 33.86,18.55 35.35,21.78 36.65,20.73 36.77,22.92 37.9,26.21 34.95,26.96 32.56,26.63 26.08,29.63 26.77,29.97 23.15,26.28 23.27,31.04 20.47,27.79 21.56,31.62 22.24,30.76 21.47,24.05 20.05,25.33 20.49,23.38 26.51,23.18 27.49,23.54 24.98,10.72 26.42,9.44 31.12,13.23 32.58,12.92 28.34,10.15 24.18,14.95 22.01,16.64 18.28,10.41 18.94,10.84 16.5,10.6 12.14,9.74 13.78,7.85 15.12,7.08 19.71,7.12 23.54,7.01 26.51,17.75 25.64,18.64 38.89,20.54 39.05,13.98 39.12,17.03 39.01,21.96 15.69,13.31 16.71,18.63 13.25,18.03 11.96,18.77 65.61,18.77 65.53,17.74 64.98,16.59 65.03,15.58 67.85,18.14 68.83,16.2 72.2,16.08 72.91,15.59 87.33,28.7 86.06,28.36 87.4,26.09 86.57,22.91 86.89,21.64 81.65,23.13 83.31,22.83 84.07,21.88 80.97,22.64 78.24,32.89 78.75,32.04 68.05,30.76 69.24,31.01 71.92,31.03 73.62,30.9 77.29,30.94 14.5,27.18 14.53,26.38 14.45,22.33 15.77,22.3 81.66,36.26 81.74,34.62 82.29,30.37 82.46,29.62 62.41,33.55 62.38,30.24 64.25,33.22 62.68,27.06 64.28,56.12 65.73,57.41 67.94,56.89 63.71,51.93 64.6,50.12 65.27,48.71 71.46,51.73 72.68,52.61 75.65,52.75 78.32,46.87 82.26,48.81 85.61,46.26 88.45,47.67 91.73,50.31 77.68,37.83 72.04,37.4 66.72,37.17 61.94,36.93 61.67,39.14 12.76,43.98 14.04,41.86 14.68,40.36 11.62,43.01 11.62,40.39 11.67,36.88 11.73,33.67 13.26,32.33 21.14,33.36 22.72,35.11 3.48,24.65 3.98,19.89 4.22,18.05 3.77,11.03 3.72,8.38 51.75,48.59 47.88,47.75 47.95,45.52 80.5,24.81 81.15,25.32 72.78,23.26 71.39,23.34 62.37,22.25 76.91,5.53 79.44,5.88 81.09,3.82 76.51,3.61 37.41,39.5 40.46,39.39 40.44,41.86 47.81,31.9 49.68,31.97 42.41,33.42 45.1,33.5 70.84,26.03 70.92,24.95 77.12,23.07
  pour Top (rank 2): -2,59 -2,-3 99,-3 99,60 -2,60
  pour Bottom (rank 2): -2,60 -2,-3 99,-3 99,60
IO0_BOOT_BUSY  (via drill 0.3)
  Top 0.254: v26.35,47.01 24.23,47.01 U5.27 24,45.81 23.47,45.28 22.31,45.28 20.6,43.57 20.6,35.85 19.82,35.07 18.14,35.07 17.15,34.08 | v30.51,47.53 35,47.53 v35.48,47.05 | v51.56,42.5 53.86,42.5 J11.6 | v81.85,14.27 83,14.27 84.35,12.92 84.35,5.47 83.69,4.81 v73.91,4.81 | v7.12,23.46 7.12,24.71 K3.2 | v7.63,30.87 13.94,30.87 17.15,34.08 | 17.15,34.08
  Top 1.016: J11.6 J11.6-6
  Bottom 0.254: P31.P$1 25.51,47.01 v26.35,47.01 29.99,47.01 v30.51,47.53 | v35.48,47.05 35.8,46.73 45.03,46.73 49.26,42.5 v51.56,42.5 | U10.3 80.47,14.27 v81.85,14.27 | v73.91,4.81 61.14,4.81 59.06,2.73 48.43,2.73 45.94,5.22 13.97,5.22 9.95,9.24 9.95,20.63 v7.12,23.46 7.12,30.36 v7.63,30.87
IO3  (via drill 0.3)
  Top 0.203: v26.7,31.72 26.03,31.05 U5.15 | U8.16 31.07,42.31 30.89,42.13 30.89,41.57 30.18,40.86 v29.5,40.86
  Bottom 0.203: v29.5,40.86 28.02,40.86 25.71,38.55 25.71,33.73 26.7,32.74 v26.7,31.72
IO3_MIC_WS  (via drill 0.3)
  Top 0.203: U8.15 30.82,42.71 30.5,42.39 30.5,41.78 30.22,41.5 v29.94,41.5
  Top 0.254: U28.3 11.61,56.13 10.88,55.4 v10.88,53.39
  Bottom 0.203: v29.94,41.5 29.94,45.73 32.68,48.47 32.68,52.4 30.62,54.45 19.68,54.45 15.83,50.6 11.43,50.6 P29.P$1
  Bottom 0.254: v10.88,53.39 10.88,52.6 P29.P$1
IO3_W_MOSI  (via drill 0.3)
  Top 0.203: J9.4 37.59,48.13 v37.37,47.91 37.24,47.78 37.08,47.62 37.08,42.41 35.52,40.85 v34.73,40.85 | U8.1 32,41.69 31.43,41.12 31.43,40.86 v31.5,40.79
  Top 1.016: J9.4 J9.4-4
  Bottom 0.203: v34.73,40.85 34.33,40.45 31.84,40.45 v31.5,40.79 | v37.37,47.91 37.55,48.09 P21.P$1
IO4_SD_MISO  (via drill 0.3)
  Top 0.203: R29.1 J5.7 14.45,13.04 v13.34,11.93 | v11.32,27.9 11.3,27.92 U5.4
  Bottom 0.203: P26.P$1 12.12,11.93 v13.34,11.93 14.42,13.01 14.42,19.59 11.32,22.69 v11.32,27.9
IO5_SD_SCK  (via drill 0.3)
  Top 0.203: J5.5 16.73,14.45 16.73,13.12 v14.21,10.6 v14.2,10.6 | U5.5 v12.57,27.84
  Bottom 0.203: P25.P$1 v14.21,10.59 v14.2,10.6 14.2,12.24 14.92,12.96 14.92,19.91 12.57,22.26 v12.57,27.84
IO6_SD_MOSI  (via drill 0.3)
  Top 0.203: J5.3 18.85,12.28 v17.54,10.97 | U5.6 v13.84,27.84 v13.85,27.83
  Top 0.508: R28.1 J5.3
  Bottom 0.203: P16.P$1 17.51,10.94 v17.54,10.97 17.54,11.66 18.34,12.46 18.37,12.49 18.37,13.49 15.39,16.47 15.39,20.18 13.85,21.72 v13.85,27.83
IO7_SD_CS  (via drill 0.3)
  Top 0.203: v19.94,13.18 J5.2 | U5.7 15.11,27.86 v15.13,27.84
  Top 0.508: R27.1 19.95,15.99 J5.2
  Bottom 0.203: P15.P$1 19.34,12.58 v19.94,13.18 19.94,13.95 15.86,18.03 15.86,20.52 15.13,21.25 v15.13,27.84
IO8_BEEP
  Top 0.254: R21.2 30.62,18.98 29.98,18.35 28,18.35 21.46,24.89 U5.12
IO9  (via drill 0.3)
  Top 0.203: U8.4 33.2,40.62 32.76,40.18 v30.16,40.18 | v26.68,33.63 25.29,33.63 U5.17
  Bottom 0.203: v30.16,40.18 28.2,40.18 26.16,38.14 26.16,34.15 v26.68,33.63
IO9_MIC_CLK  (via drill 0.3)
  Top 0.203: U8.3 32.8,41.35 v32.46,41.01 | v11.97,53.11 11.97,54 U28.1
  Bottom 0.203: v32.46,41.01 31.25,42.22 31.25,46.39 33.04,48.18 33.04,52.69 30.92,54.81 19.41,54.81 16.5,51.9 P27.P$1 11.97,52.45 v11.97,53.11
IO9_W_MISO  (via drill 0.3)
  Top 0.203: U8.5 36.39,42.31 36.71,42.63 36.71,50.04 v37.34,50.67 J9.3
  Top 1.016: J9.3-3 J9.3
  Bottom 0.203: v37.34,50.67 P22.P$1
IO10  (via drill 0.3)
  Top 0.203: U5.18 26.71,34.86 v26.73,34.88 | U8.8 34.19,43.51 34.68,44 35.12,44 v35.61,43.51
  Bottom 0.203: v26.73,34.88 26.73,37.73 28.6,39.6 34.73,39.6 35.52,40.39 35.52,43.42 v35.61,43.51
IO10_MIC_SD  (via drill 0.3)
  Top 0.203: U8.7 34.6,43.11 v34.85,43.36 | U28.2 12.08,55.16 v13.15,55.16 14.34,55.16 R1.1
  Bottom 0.203: v34.85,43.36 34.85,51.68 31.36,55.17 P24.P$1 v13.16,55.17 v13.15,55.16
IO10_W_CLK  (via drill 0.3)
  Top 0.203: U8.9 33.85,44.46 35.68,44.46 36.16,44.94 36.16,52.12 v37.28,53.24 38.92,53.24 J9.2
  Top 1.016: J9.2 J9.2-2
  Bottom 0.203: v37.28,53.24 38.86,53.24 P23.P$1
IO11_I2S_LRCLK  (via drill 0.3)
  Top 0.254: R65.2 54.97,28.84 v55.19,29.06 | v53.53,33.52 50.91,36.13 U5.19
  Bottom 0.254: v55.19,29.06 55.19,31.86 v53.53,33.52
IO12_I2S_SDIN
  Top 0.254: U5.20 26.23,37.4 27.08,36.55 51.32,36.55 54.2,33.67 R62.2
IO13_I2S_BCLK
  Top 0.254: R56.2 54.19,30.11 54.81,30.74 54.81,33.7 51.48,37.03 27.24,37.03 25.6,38.67 U5.21
IO14_MUTE
  Top 0.254: R52.2 50.08,25.01 50.36,25.29 54.59,25.29 55.94,26.64 55.94,33.61 52.08,37.47 27.48,37.47 26.34,38.61 26.34,39.24 25.64,39.94 U5.22
IO15_SDA  (via drill 0.3)
  Top 0.254: J11.3-3 v59.71,50.69 61.02,50.69 65.82,55.49 68.24,55.49 68.5,55.23 68.5,53.24 69.12,52.62 70.83,52.62 71.37,53.16 71.37,54.4 U4.5 | J13.2 38.46,5.18 37.34,4.06 33.39,4.06 32.84,4.61 32.84,9.68 24.61,17.91 18.87,17.91 v17.98,18.8 | R37.1 18.38,25.1 18.13,25.35 v16.66,25.35 16.66,29.01 U5.8 16.38,32.61 18.18,34.41 v20.32,34.41 | v35.46,49.59 32.69,49.59 v31.8,48.7
  Top 1.016: J11.3 J11.3-3
  Bottom 0.254: v17.98,18.8 16.66,20.12 v16.66,25.35 | FPC2.3 55.94,44.93 57.51,46.5 P39.P$1 | P39.P$1 57.53,50.69 v59.71,50.69 | v20.32,34.41 20.32,44.73 24.29,48.7 v31.8,48.7 | v35.46,49.59 35.5,49.55 56.39,49.55 P39.P$1
IO16_SCL  (via drill 0.3)
  Top 0.203: U5.9 17.65,26.74 19.26,25.13 19.26,23.3 19.05,23.09 R38.1
  Top 0.254: J11.2-2 v59.74,53.23 62.93,53.23 65.6,55.9 68.44,55.9 68.96,55.38 68.96,53.49 69.37,53.08 70.55,53.08 70.76,53.29 70.76,54.39 U4.6 | R38.1 18.07,22.8 18.07,22.75 17.14,21.82 17.14,20.61 19.39,18.36 24.74,18.36 33.25,9.85 33.25,4.94 33.72,4.47 36.9,4.47 37.45,5.02 37.45,8.67 37.89,9.11 39.48,9.11 39.51,9.08 40.01,9.08 40.51,8.58 40.51,6.84 J13.1 | v35.41,51.82 34.02,51.82 v31.88,49.68 | v19.74,33.63 18.56,33.63 17.65,32.72 U5.9
  Top 1.016: J11.2-2 J11.2
  Bottom 0.254: FPC2.4 56.35,44.43 60.45,48.53 60.45,52.52 v59.74,53.23 P40.P$1 57.41,53.1 54.64,50.33 41.16,50.33 39.67,51.82 v35.41,51.82 | v31.88,49.68 31.39,49.19 24.1,49.19 19.74,44.83 v19.74,33.63
IO21_SHUT  (via drill 0.3)
  Top 0.254: R48.2 44.43,23.58 R49.1 43.38,23.57 v43.38,22.45 | v56.63,29.04 56.63,33.92 52.64,37.91 27.64,37.91 26.84,38.71 26.84,40.01 25.64,41.21 U5.23
  Bottom 0.254: v56.63,29.04 56.63,28.43 55.98,27.78 45.89,27.78 43.38,25.27 v43.38,22.45
IO38_LED_BK  (via drill 0.3)
  Top 0.254: U5.31 18.92,47.36 19.62,48.06 26.22,48.06 v28.47,45.81 | v28.45,44.2 28.45,40.37 29.31,39.51 v36.38,39.51 v36.39,39.52
  Bottom 0.254: v28.47,45.81 28.47,44.22 v28.45,44.2 | v36.39,39.52 36.39,38.13 36.22,37.96 R33.2
IO39_TFT_SDA  (via drill 0.3)
  Top 0.254: v17.65,44.85 U5.32
  Bottom 0.203: P53.P$1 22.86,21.4 24.24,20.02 24.24,17.5 26.18,15.56 FPC1.P$32
  Bottom 0.254: P53.P$1 22.86,24.06 17.65,29.27 v17.65,44.85
IO40_TFT_CS  (via drill 0.3)
  Top 0.254: U5.33 16.38,44.56 v16.35,44.53
  Bottom 0.203: FPC1.P$36 26.61,13.56 22.87,17.3 20.53,17.3 P52.P$1
  Bottom 0.254: v16.35,44.53 17.14,43.74 17.14,42.83 17.14,42.67 17.14,28.82 19.14,26.82 19.14,18.69 20.53,17.3
IO41_TFT_RS  (via drill 0.3)
  Top 0.254: U5.34 15.11,44.56 v16.1,43.57 | v18.43,20.44 19.72,19.15 v20.6,19.15
  Bottom 0.203: P51.P$1 22.83,19.06 22.83,17.9 26.67,14.06 FPC1.P$35
  Bottom 0.254: v16.1,43.57 16.66,43.01 16.66,28.42 18.43,26.65 v18.43,20.44 | v20.6,19.15 22.74,19.15 22.83,19.06
IO42_TFT_SCK  (via drill 0.3)
  Top 0.254: U5.35 13.84,44.79 v14.98,43.65 | v17.77,21.56 18.09,21.24 21.52,21.24 v21.87,20.89
  Bottom 0.203: FPC1.P$34 26.67,14.56 23.87,17.36 23.87,19.8 22.78,20.89 v21.87,20.89 P50.P$1
  Bottom 0.254: v14.98,43.65 16.15,42.48 16.15,26.68 17.77,25.06 v17.77,21.56
IO45_SPISW_ITCHING
  Top 0.203: U8.2 32.4,42.66 32.8,43.06 U8.10 32.8,44.47 33.08,44.75 R64.1 33.08,45.71 32.83,45.96 30.32,45.96 29.38,45.02 U5.26
IO46_W_CS  (via drill 0.3)
  Top 0.254: U5.16 23.73,32.32 v23.48,32.57 | J11.5 53.09,45.61 49.73,48.97 v48.14,48.97 | v35.56,48.66 32.83,48.66 32.28,48.11 v29.85,48.11 v29.84,48.12
  Top 1.016: J11.5-5 J11.5
  Bottom 0.254: P32.P$1 23.69,32.36 v23.48,32.57 20.77,35.28 20.77,44.27 21.2,44.7 24.62,48.12 v29.84,48.12 | v48.14,48.97 47.99,49.12 36.02,49.12 v35.56,48.66
IO47_TP_INT  (via drill 0.3)
  Top 0.254: v50.19,44.36 50.19,40.89 47.68,38.38 27.83,38.38 27.3,38.91 27.3,40.95 25.77,42.48 U5.24 22.37,42.48 v21.63,41.74
  Bottom 0.254: FPC2.2 50.72,45.43 50.19,44.9 v50.19,44.36 | P63.P$1 21.93,42.04 v21.63,41.74
IO48_TP_RST  (via drill 0.3)
  Top 0.254: v49.68,45.33 49.57,45.22 49.57,40.84 47.51,38.79 28.03,38.79 27.73,39.09 27.73,41.65 25.63,43.75 U5.25 22.23,43.75 v21.76,43.28
  Bottom 0.254: FPC2.1 50.28,45.93 v49.68,45.33 | v21.76,43.28 22.7,44.22 P64.P$1
IOT_5V  (via drill 0.3)
  Top 0.508: v37.08,40.51 J9.7
  Top 1.016: J9.7 J9.7-7
  Bottom 0.508: L3.1 39,40.43 P62.P$1 v37.09,40.5 v37.08,40.51
LCD_LEDK
  Bottom 0.305: FPC1.P$2 31.67,30.56 33.45,32.34 33.45,34.63 33.06,35.02 31.7,35.02 31.39,35.33 R25.2 29.24,38.31 P56.P$1
MUTE
  Top 0.406: U9.1 49.55,23.57
  Top 0.508: R51.1 49.55,23.57 R52.1 51.03,23.57 R47.2
N$1
  Top 0.508: R61.1 14.35,57.16 | 14.35,57.16 R2.2 | U28.4 14.33,57.18 14.35,57.16
N$2  (via drill 0.3)
  other vias: 29.32,46.16
N$3  (via drill 0.3)
  Top 0.203: J2.B5 88.06,32.27 86.6,33.73 v84.8,33.73
  Bottom 0.203: v84.8,33.73 84.27,34.26 R36.1
N$4  (via drill 0.3)
  Top 0.203: J2.A5 84.71,29.27 v83.78,30.2
  Bottom 0.203: v83.78,30.2 83.78,31.06 R5.2
N$5
  Bottom 0.254: R4.1 83.44,19.5 83.17,19.78 U1.1
N$6
  Bottom 0.254: U1.2 82.36,18.78 83.35,17.79 R6.1
N$7
  Bottom 0.203: U10.2 79.17,13.19 79.54,12.82 80.51,12.82 80.81,13.12 R10.1
N$8
  Bottom 0.203: U10.5 79.17,12.47 78.91,12.73 78.09,12.73 77.57,12.21 R3.1
N$9
  Bottom 0.406: U1.10 74.95,19.78 C2.2
N$10
  Bottom 0.406: U1.9 74.96,18.78 R7.2
N$11
  Bottom 0.406: U1.8 74.93,17.78 R8.2
N$12
  Bottom 0.254: U2.6 63.78,18.07 R16.2
N$13
  Top 0.762: L2.1 74.02,25.41 74.72,24.71 77.49,24.71 77.71,24.93 U3.3
N$14
  Top 0.254: Q4.1 31.6,20.52 R21.1 30.62,21.62 R23.1
N$15
  Top 0.254: D5.+ 33.66,21.88 Q4.3 34.08,19.74 B1.2
N$16
  Top 0.254: D5.- 33.42,23.54 R24.1 35.19,23.61 B1.1
N$17
  Top 0.254: R48.1 44.63,24.62 Q7.1
N$18
  Top 0.381: Q5.2 74.94,48.6 66.96,40.63 BT1.P
N$19
  Bottom 0.254: U14.6 80.62,32.77 81.11,32.28 81.11,28.95 82.39,27.68 R59.2
N$20
  Bottom 0.254: U14.5 80.75,33.27 81.54,32.48 81.54,29.57 82.27,28.83 R60.2
N$21  (via drill 0.3)
  Top 0.254: D14.+ 93.73,46.47 91.93,46.47 90.88,45.42 90.88,43.35 83.83,36.3 v83.81,36.3
  Bottom 0.254: v83.81,36.3 83.81,35.34 R31.1
N$22
  Bottom 0.305: R25.1 31.18,37.89 Q6.3
N$23  (via drill 0.3)
  Top 0.254: v36.94,56.83 37.02,56.91 37.79,56.91 J9.1
  Top 1.016: J9.1 J9.1-1
  Bottom 0.254: R43.1 36.96,56.81 v36.94,56.83
N$24  (via drill 0.3)
  Top 0.254: J11.1-1 58.53,56.71 v59.59,56.71
  Top 1.016: J11.1 J11.1-1
  Bottom 0.254: v59.59,56.71 v59.6,56.7 R39.1
N$25
  Top 0.381: U4.8 69.44,55.59 69.97,56.13 72.68,56.13 73,55.81 C11.1 73.59,54.88 74.02,54.45 Q5.3
N$26
  Top 0.254: C21.1 67.69,53.82 Y1.2 67.67,53.42 70.08,51.01 U4.2
N$27
  Top 0.254: Q8.1 39.19,11.77 R63.2
N$28
  Top 0.508: C29.1 49.49,19.48 U9.3
N$29
  Bottom 0.203: Q6.1 34.05,39.02 R34.1 34.27,38.84 R33.1
N$30
  Top 0.254: 69.44,50.73 U4.1 69.44,50.91 69.16,51.19 67.56,51.19 Y1.1 67.35,50.92 67.77,50.5 C20.2
N$31
  Top 0.305: R20.2 R19.1 76.72,28.84 76.42,28.55 75.83,28.55 U3.5
N$32  (via drill 0.3)
  other vias: 80.51,15.02
N$33
  Bottom 0.203: FPC1.P$5 25.79,29.06 25.42,29.43 R67.1
N$34
  Top 0.508: R44.2 46.64,20.55 C29.2 45.44,19.48 C44.1 45.42,20.57 C27.2
N$35
  Top 0.508: U9.13 56.36,18.27 R53.2
N$36
  Top 0.508: U9.4 49.48,18.2 C47.2
N$37
  Top 0.508: R66.2 45.85,13.26 45.6,13.51 44.69,13.51 R50.3
N$38
  Top 0.254: U7.1 R55.1
N$39
  Top 0.254: U7.2 53.27,28.84 R65.1
N$40  (via drill 0.3)
  Top 0.254: D6.3 93.19,44.49 92.93,44.74 91.96,44.74 91.53,44.31 91.53,43.02 81.99,33.48 v73.59,33.48
  Bottom 0.254: R40.2 62.25,19.05 65.38,22.18 65.38,30.96 67.99,33.57 73.5,33.57 v73.59,33.48 73.61,33.46 R26.2
N$41
  Bottom 0.203: R68.1 25.02,28.56 FPC1.P$6
N$42
  Bottom 0.203: FPC1.P$7 26.34,28.06 26.08,27.8 24.98,27.8 R69.1
N$43  (via drill 0.3)
  Top 0.254: v75.46,23.87 77.3,23.87 v77.31,23.86 | v83.76,26.86 83.76,28.52 83.19,29.09 83.19,33.91 92.33,43.05 D6.4
  Bottom 0.254: R54.2 66.92,17.85 66.92,23.35 67.66,24.09 75.24,24.09 v75.46,23.87 | v77.31,23.86 78.27,22.9 79.65,22.9 82.06,25.31 83.56,25.31 83.76,25.51 83.76,26.08 R32.2 83.74,26.84 v83.76,26.86
N$44
  Bottom 0.203: FPC1.P$13 FPC1.P$14 FPC1.P$15 FPC1.P$16 FPC1.P$17 FPC1.P$18 FPC1.P$19 FPC1.P$20 FPC1.P$21 FPC1.P$22 FPC1.P$23 | FPC1.P$23 FPC1.P$24 FPC1.P$25 FPC1.P$26 FPC1.P$27 FPC1.P$28 FPC1.P$29 FPC1.P$30 | R70.1 24.95,20.06 FPC1.P$23
N$45  (via drill 0.3)
  other vias: 40.77,11.89
N$46
  Top 0.254: U7.3 R56.1 | R56.1
N$47
  Top 0.254: U7.4 52.95,31.39 53.17,31.39 R62.1
N$49
  Top 0.508: U7.6 46.12,30.09 45.35,30.09 44.85,30.6 44.85,32.05 45.55,32.75 C31.1 47.83,32.75 48.03,32.95 C36.1 48.03,34.35 48.49,34.81 50.8,34.81 51.27,34.34 R46.2
N$50
  Top 0.508: C30.1 44.32,27.57
  Top 0.635: 44.32,27.57 U7.8
N$53  (via drill 0.3)
  other vias: 82.29,15
N$54  (via drill 0.3)
  other vias: 79.35,29.45
N$55  (via drill 0.3)
  other vias: 17.81,17.69
N$56  (via drill 0.3)
  other vias: 80.52,29.33
N$57  (via drill 0.3)
  other vias: 80.5,30.09
N$67  (via drill 0.3)
  other vias: 94.93,48.69
OTG_D+  (via drill 0.3)
  Top 0.203: J2.A6 87.82,30.27 87.07,31.02 v85.71,31.02 85.98,31.29 88.91,31.29 J2.B6
  Bottom 0.203: R42.2 84.46,33.2 85.71,31.95 v85.71,31.02 85.71,30.58 85.95,30.34 89.97,30.34 91.14,31.51 P7.P$1
OTG_D-  (via drill 0.3)
  Top 0.203: v84.57,31.62 84.57,30.31 85.11,29.77 J2.B7 90,29.77 90.1,29.87 90.1,30.67 90,30.77 J2.A7
  Bottom 0.203: R41.2 84.3,32.17 84.57,31.9 v84.57,31.62 84.57,30.31 85.4,29.48 P6.P$1
ROUT+  (via drill 0.3)
  Top 0.635: U9.14 54.06,19.54 53.48,18.95 v53.48,7.89 53.48,3.6 J12.1 53.49,2.96 53.83,2.62 C33.2
  Bottom 0.635: v53.48,7.89 53.48,6.86 P30.P$1
ROUT-  (via drill 0.3)
  Top 0.635: U9.16 53.45,22.07 51.48,20.1 v51.48,7.87 51.48,3.6 J12.2 51.49,2.99 51.17,2.67 C34.2
  Bottom 0.635: P42.P$1 51.48,6.98 v51.48,7.87
RTS
  Bottom 0.203: U10.1 78.07,13.62 77.55,13.1 R3.2 76.83,15.56 76.61,15.78 U1.6
RXD  (via drill 0.3)
  Top 0.203: v84.83,22.66 84.83,21.27 85.36,20.74 J1.B5 89.86,20.74 90.53,20.07 90.53,18.06 90.21,17.74 J1.A5
  Bottom 0.203: P78.P$1 v84.83,22.66
  Bottom 0.254: R60.1 84.11,28.83 85.01,27.93 85.01,24.27 P78.P$1
RXD0_H  (via drill 0.3)
  Top 0.254: J10.1 83.15,9.9 82.63,10.42 v81.94,10.42
  Bottom 0.254: R8.1 73.19,17.81 72.57,18.43 R13.1 72.41,18.98 71.98,19.4 Q2.3 71.47,14.18 75.23,10.42 v81.94,10.42 82.46,10.42 83.2,9.68 P20.P$1
SHUT
  Top 0.508: U9.2 48.44,20.8 48.14,21.1 R45.1 47.64,23.55 Q7.3
TFT_3V3  (via drill 0.3)  (1 unrouted)
  Top 0.254: v30.29,31.49 30.5,31.28 v30.5,29.76
  Bottom 0.203: FPC1.P$38 25.7,12.56 25.1,13.16 | FPC1.P$39 27.96,12.08 25.95,12.08 24.47,13.56
  Bottom 0.254: FPC1.P$39 29.78,12.06 30.08,12.36 30.08,29.34 v30.5,29.76 | v30.29,31.49 29.86,31.06 FPC1.P$1 26.96,31.06 26.16,30.26 24.35,30.26 24.07,29.98 R67.2 R68.2 R69.2
  Bottom 0.508: FB3.2 C13.2 | C13.2 C17.2 24.47,13.56 | 24.49,13.56 24.7,13.56 25.1,13.16 25.98,12.28 29.51,12.28 | P55.P$1 22.84,15.54 C13.2
TFT_RST
  Bottom 0.203: P49.P$1 25.18,22.76 D1.+ 24.95,25.2 C18.2 R22.1 25.97,27.02 26.51,27.56 FPC1.P$8
TXD  (via drill 0.3)
  Top 0.203: J1.A8 88.9,20.27 84.47,20.27 | 84.47,20.27 82.41,22.33 v82.41,22.58 | J1.B8 85.93,17.24 85.79,17.1 84.87,17.1 84.45,17.52 84.45,20.25 84.47,20.27
  Bottom 0.203: v82.41,22.58 v82.4,22.59 P14.P$1
  Bottom 0.254: P14.P$1 83.13,24.09 84.6,25.56 84.6,27.35 84.27,27.68 R59.1
TXD0_H  (via drill 0.3)
  Top 0.254: v79.29,9.66 80.48,9.66 80.65,9.49 J10.2
  Bottom 0.254: R7.1 73.55,18.73 73.27,19.01 73.27,21.85 73.06,22.06 R11.1 71.88,22.06 Q1.3 70.81,20.99 70.81,13.91 75.06,9.66 v79.29,9.66 80.17,9.66 80.65,9.18 P19.P$1
USB_D+  (via drill 0.3)
  Top 0.254: J1.B6 85.73,19.74 85.37,19.38 v85.37,19.1 85.37,19.01 85.64,18.74 J1.A6
  Bottom 0.254: R4.2 85.01,18.74 v85.37,19.1 87.17,19.1 87.88,19.81 P2.P$1
USB_D-  (via drill 0.3)
  Top 0.254: v85.3,17.77 85.77,18.24 J1.B7 89.87,18.24 90.13,18.5 90.13,19.06 89.95,19.24 J1.A7
  Bottom 0.254: R6.2 84.36,17.77 v85.3,17.77 v85.31,17.78 P3.P$1
VBAT  (via drill 0.3)
  Top 0.762: J3.P$1 66.18,8.21 v66.2,8.23 63.38,11.05 63.38,17.75 65.33,19.7 Q3.3
  Bottom 0.508: 65.8,13.58 C4.2 66.2,11.77 v66.2,8.23 66.2,6.69 P9.P$1 | 65.8,13.58 65.8,14.36 U2.3 | R17.1 65.77,13.55 65.8,13.58
VIN  (via drill 0.3)
  Top 0.508: Q3.2 70.86,20.65 62.76,20.65 59.23,24.18 FB1.1 58.62,24.2 v58.62,26.64
  Top 0.762: Q3.2 v71.78,20.59 72.46,20.59 D4.- | D4.- 72.76,19.17 D10.- D2.- | D4.- 72.76,21.55 73.42,22.21 v75.25,22.21 77.9,22.21 79.66,23.97 C5.2 79.68,26.52 C9.2 79.44,28.57 U3.4 77.71,28.43 76.7,27.42 76.28,27.42 75.81,26.95 U3.1
  Bottom 0.203: 73.65,23.01 P11.P$1
  Bottom 0.254: P74.P$1 75.26,29.17 C48.2 75.67,32.27 U14.2 | R13.2 72.57,20.55 | 72.57,20.55 72.57,21.17 R11.2 | 72.57,20.55 71.82,20.55 v71.78,20.59
  Bottom 0.508: P74.P$1 76.38,23.34 v75.25,22.21 | L3.2 46.76,40.43 51.25,35.94 51.25,30.56 53.5,28.31 55.59,28.31 55.91,28.63 55.91,29.79 56.21,30.09 58.21,30.09 58.62,29.68 v58.62,26.64
  Bottom 0.762: v75.25,22.21 74.45,22.21 P11.P$1
VOLU
  Top 0.508: C45.2 47.87,16.6 47.87,14.5 | 47.87,14.5 R50.2 | U9.7 49.51,14.5 47.87,14.5

## Text on the board
tPlace: IIC address : 0X51 | IO15-RTC_SDA | IO16-RTC_SCL | IO18-RX1 | IO17-TX1 | 3V3 | GND | ESP32 Display / 3.5 inch | (Advance_series) | SKU:DIS01835A | OTG | V1.0 | UART0 | IO15_SDA | IO16_SCL | GND | 3V3 | GND | 5V_IN | IO43-TX0 | IO44-RX0 | + | + | - | -
tNames: U4